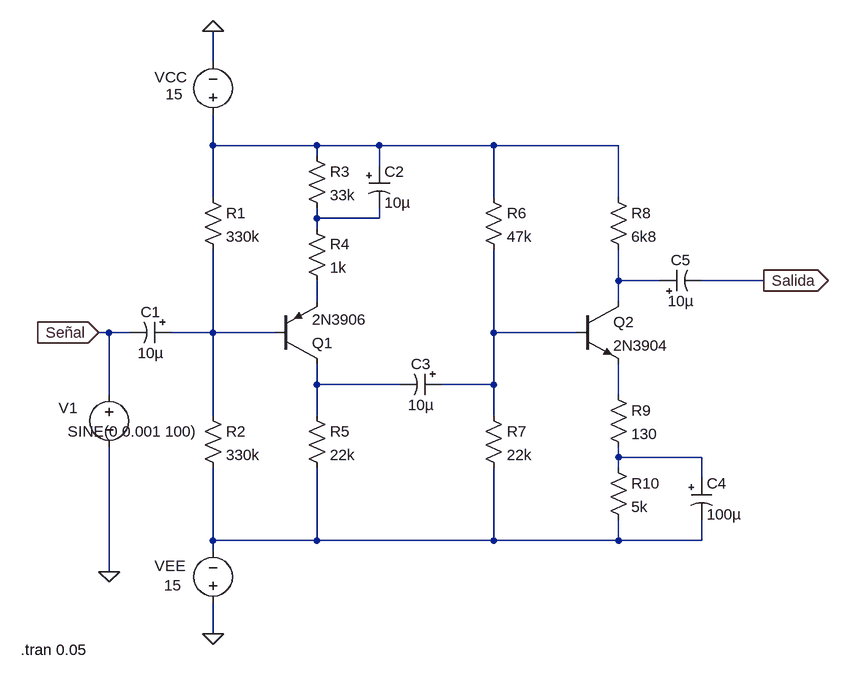
[diagram p0: schematic amplificador-dos-etapas.asc]
amplificador-dos-etapas.asc, the LTspice schematic file:
Version 4
SHEET 1 1204 680
WIRE 208 -240 208 -288
WIRE 208 -112 208 -160
WIRE 368 -112 208 -112
WIRE 464 -112 368 -112
WIRE 640 -112 464 -112
WIRE 832 -112 640 -112
WIRE 368 -96 368 -112
WIRE 464 -80 464 -112
WIRE 208 -32 208 -112
WIRE 640 -32 640 -112
WIRE 832 -32 832 -112
WIRE 368 0 368 -16
WIRE 464 0 464 -16
WIRE 464 0 368 0
WIRE 368 16 368 0
WIRE 832 96 832 48
WIRE 896 96 832 96
WIRE 1056 96 960 96
WIRE 368 128 368 96
WIRE 832 128 832 96
WIRE 48 176 32 176
WIRE 80 176 48 176
WIRE 208 176 208 48
WIRE 208 176 144 176
WIRE 304 176 208 176
WIRE 640 176 640 48
WIRE 768 176 640 176
WIRE 368 256 368 224
WIRE 496 256 368 256
WIRE 640 256 640 176
WIRE 640 256 560 256
WIRE 48 272 48 176
WIRE 832 272 832 224
WIRE 208 304 208 176
WIRE 368 304 368 256
WIRE 640 304 640 256
WIRE 832 368 832 352
WIRE 960 368 832 368
WIRE 832 384 832 368
WIRE 960 400 960 368
WIRE 208 496 208 384
WIRE 368 496 368 384
WIRE 368 496 208 496
WIRE 640 496 640 384
WIRE 640 496 368 496
WIRE 832 496 832 464
WIRE 832 496 640 496
WIRE 960 496 960 464
WIRE 960 496 832 496
WIRE 208 512 208 496
WIRE 48 544 48 352
WIRE 208 640 208 592
FLAG 32 176 Señal
IOPIN 32 176 In
FLAG 48 544 0
FLAG 208 -288 0
FLAG 1056 96 Salida
IOPIN 1056 96 Out
FLAG 208 640 0
SYMBOL polcap 144 160 R90
WINDOW 0 0 32 VBottom 2
WINDOW 3 32 32 VTop 2
SYMATTR InstName C1
SYMATTR Value 10µ
SYMBOL res 192 -48 R0
SYMATTR InstName R1
SYMATTR Value 330k
SYMBOL res 192 288 R0
SYMATTR InstName R2
SYMATTR Value 330k
SYMBOL pnp 304 224 M180
SYMATTR InstName Q1
SYMATTR Value 2N3906
SYMBOL res 352 0 R0
SYMATTR InstName R4
SYMATTR Value 1k
SYMBOL res 352 288 R0
SYMATTR InstName R5
SYMATTR Value 22k
SYMBOL res 352 -112 R0
SYMATTR InstName R3
SYMATTR Value 33k
SYMBOL polcap 448 -80 R0
SYMATTR InstName C2
SYMATTR Value 10µ
SYMBOL polcap 560 240 R90
WINDOW 0 0 32 VBottom 2
WINDOW 3 32 32 VTop 2
SYMATTR InstName C3
SYMATTR Value 10µ
SYMBOL npn 768 128 R0
SYMATTR InstName Q2
SYMATTR Value 2N3904
SYMBOL res 624 -48 R0
SYMATTR InstName R6
SYMATTR Value 47k
SYMBOL res 624 288 R0
SYMATTR InstName R7
SYMATTR Value 22k
SYMBOL res 816 -48 R0
SYMATTR InstName R8
SYMATTR Value 6k8
SYMBOL res 816 256 R0
SYMATTR InstName R9
SYMATTR Value 130
SYMBOL res 816 368 R0
SYMATTR InstName R10
SYMATTR Value 5k
SYMBOL polcap 944 400 R0
SYMATTR InstName C4
SYMATTR Value 100µ
SYMBOL polcap 896 112 R270
WINDOW 0 32 32 VTop 2
WINDOW 3 0 32 VBottom 2
SYMATTR InstName C5
SYMATTR Value 10µ
SYMBOL voltage 48 256 R0
WINDOW 0 -78 36 Left 2
WINDOW 3 -64 72 Left 2
WINDOW 123 0 0 Left 0
WINDOW 39 0 0 Left 0
SYMATTR InstName V1
SYMATTR Value SINE(0 0.001 100)
SYMBOL voltage 208 -144 R180
WINDOW 0 40 73 Left 2
WINDOW 3 46 47 Left 2
SYMATTR InstName VCC
SYMATTR Value 15
SYMBOL voltage 208 608 R180
WINDOW 0 43 73 Left 2
WINDOW 3 48 43 Left 2
SYMATTR InstName VEE
SYMATTR Value 15
TEXT -88 664 Left 2 !.tran 0.05

The netlist it stands for:
* amplificador-dos-etapas.asc
C1 N005 Señal 10µ
R1 N001 N005 330k
R2 N005 N010 330k
Q1 N007 N005 N004 0 2N3906
R4 N002 N004 1k
R5 N007 N010 22k
R3 N001 N002 33k
C2 N001 N002 10µ
C3 N006 N007 10µ
Q2 N003 N006 N008 0 2N3904
R6 N001 N006 47k
R7 N006 N010 22k
R8 N001 N003 6k8
R9 N008 N009 130
R10 N009 N010 5k
C4 N009 N010 100µ
C5 N003 Salida 10µ
V1 Señal 0 SINE(0 0.001 100)
VCC N001 0 15
VEE 0 N010 15
.model NPN NPN
.model PNP PNP
.lib standard.bjt
.tran 0.05
.backanno
.end